# Altium schematic sheet Power.SchDoc
size A4; SheetNumber: 3; SheetTotal: 3
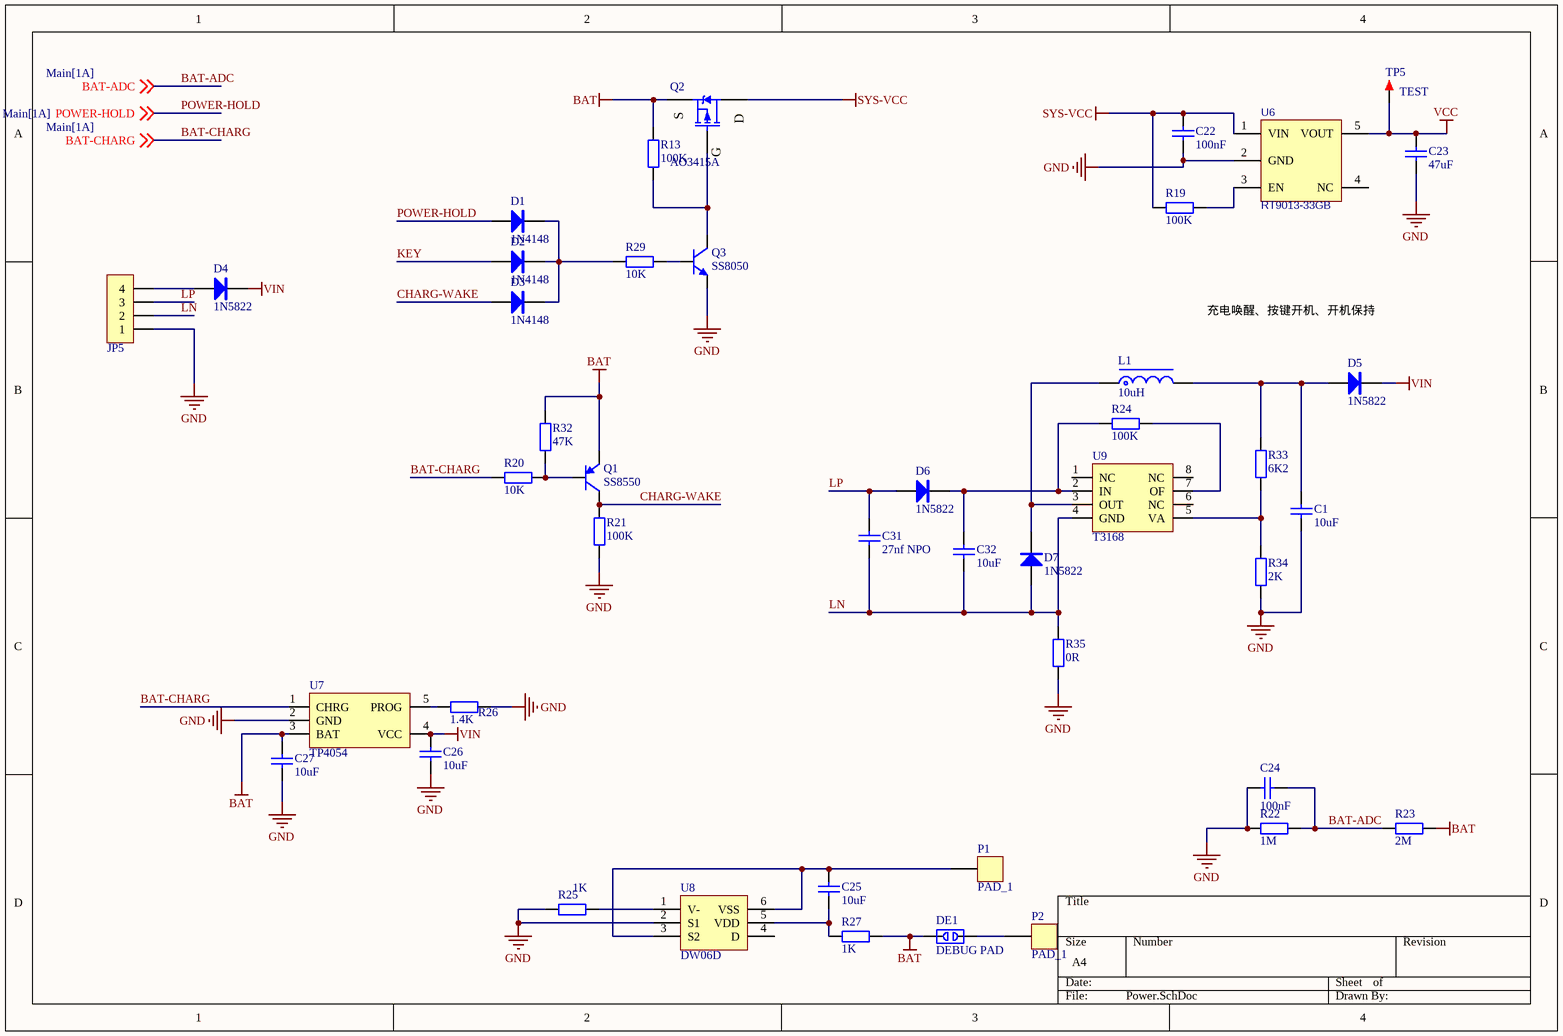
[diagram p0: Power.SchDoc]

## Parts
C1  10uF  [C1206_M]
C22  100nF  [C0402_M]
C23  47uF  [C0603_L]
C24  100nF  [C0402_M]
C25  10uF  [C0402_M]
C26  10uF  [C0402_M]
C27  10uF  [C0402_M]
C31  27nf NPO  [C1206_M]
C32  10uF  [C1206_M]
D1  1N4148  [SOD-323]
D2  1N4148  [SOD-323]
D3  1N4148  [SOD-323]
D4  1N5822  [SOD-123]
D5  1N5822  [SOD-123]
D6  1N5822  [SOD-123]
D7  1N5822  [SOD-123]
DE1  DEBUG PAD  [DEBUG_A]
JP5  HDR-1X4  [HDR2.54-LI-4P]  (value not drawn)
L1  10uH  [SWPA3012]
P1  PAD_1  [PAD-3.2X1.7]
P2  PAD_1  [PAD-3.2X1.7]
Q1  SS8550  [SOT23-3N]
Q2  AO3415A  [SOT23-3N]
Q3  SS8050  [SOT23-3N]
R13  100K  [R0402_M]
R19  100K  [R0402_M]
R20  10K  [R0402_M]
R21  100K  [R0402_M]
R22  1M  [R0402_M]
R23  2M  [R0402_M]
R24  100K  [R0402_M]
R25  1K  [R0402_M]
R26  1.4K  [R0402_M]
R27  1K  [R0402_M]
R29  10K  [R0402_M]
R32  47K  [R0402_M]
R33  6K2  [R0402_M]
R34  2K  [R0402_M]
R35  0R  [R0805_M]
TP5  TEST  [TEST 1.2]
U6  RT9013-33GB  [SOT-23-5]
U7  TP4054  [SOT23-5]
U8  DW06D  [SOT23-6L]
U9  T3168  [SOP8]

## Nets
BAT: C27.1 DE1.1 Q1.2(E) Q2.2(S) R13.2 R23.2 R27.2 R32.2 U7.3(BAT)
GND: C1.1 C22.1 C23.1 C24.2 C26.2 C27.2 JP5.1 Q3.2(E) R21.1 R22.1 R25.1 R26.2 R34.1 R35.2 U6.2(GND) U7.2(GND) U8.2(S1)
SYS-VCC: C22.2 Q2.3(D) R19.1 U6.1(VIN)
VCC: C23.2 TP5.1 U6.5(VOUT)
VIN: C26.1 D4.2(K) D5.2(K) U7.4(VCC)
BAT-ADC: C24.1 R22.2 R23.1 ; off-sheet BAT-ADC
BAT-CHARG: R20.2 U7.1(CHRG) ; off-sheet BAT-CHARG
CHARG-WAKE: D3.1(A) Q1.3(C) R21.2
KEY: D2.1(A)
LN: C31.1 C32.1 D7.1(A) JP5.2 R35.1 U9.4(GND)
LP: C31.2 D6.1(A) JP5.3
POWER-HOLD: D1.1(A) ; off-sheet POWER-HOLD
NetC1_2: C1.2 D5.1(A) L1.2 R33.2
NetC25_1: C25.1 P1.1 U8.3(S2) U8.6(VSS)
NetC25_2: C25.2 R27.1 U8.5(VDD)
NetC32_2: C32.2 D6.2(K) R24.1 U9.2(IN)
NetD1_2: D1.2(K) D2.2(K) D3.2(K) R29.2
NetD4_1: D4.1(A) JP5.4
NetD7_2: D7.2(K) L1.1 U9.3(OUT)
NetDE1_2: DE1.2 P2.1
NetQ1_1: Q1.1(B) R20.1 R32.1
NetQ2_1: Q2.1(G) Q3.3(C) R13.1
NetQ3_1: Q3.1(B) R29.1
NetR19_2: R19.2 U6.3(EN)
NetR24_2: R24.2 U9.7(OF)
NetR25_2: R25.2 U8.1(V-)
NetR26_1: R26.1 U7.5(PROG)
NetR33_1: R33.1 R34.2 U9.5(VA)

Not connected (* = marked no-connect by the designer): U6 4(NC); U8 4(D); U9 1(NC) 6(NC) 8(NC)

## Notes on the sheet
- 充电唤醒、按键开机、开机保持

## Library data of the parts
C1 C22-C27 C31 C32 = C: 贴片电容/MLCC电容; BOM名称: 无极性贴片电容; 联系下单店铺卖家 免费帮你查找封装: 联系下单店铺卖家 免费技术支持
D1-D3 = 1N4148: 开关二极管; BOM名称: 高速开关二极管; 以赠品形式获赠本封装库的买家，还可联系卖家免费指导AD软件使用: 封装库来自淘宝卖家ID：黄晶宝石
D4-D7 = 1N5822: 肖特基二极管; 以赠品形式获赠本封装库的买家，还可联系卖家免费指导AD软件使用: 封装库来自淘宝卖家ID：黄晶宝石; BOM名称: 肖特基二极管
DE1 = DEBUG: 调试断点焊盘; 联系卖家，免费查找封装: 唯一出售店铺网址https://shop463601444.taobao.com; 封装库来自淘宝卖家：黄晶宝石: 其他店铺购入均为盗版封装库，请立即申请退款，本店现金奖励200~1000元; BOM名称: 调试断点焊盘
JP5 = Header 4: 4P接插件; 联系卖家，免费查找封装: 唯一出售店铺网址https://shop463601444.taobao.com; 封装库来自淘宝卖家ID：黄晶宝石: 其他店铺购入均为盗版封装库，请立即申请退款，本店现金奖励50~200元; BOM名称: 4P接插件
L1 = L-SWPA: 顺络_SWPA贴片屏蔽电感; BOM名称: 功率屏蔽电感; 联系下单店铺卖家 免费帮你查找封装: 联系下单店铺卖家 免费技术支持
P1 P2 = PAD_1: 焊盘
Q1 = 8550-SMD: 高频放大-PNP型; 参数: 40V 1.5A 1W 100MHZ; 8元以下特价购入的买家: 还可以联系卖家远程指导AD软件使用; BOM名称: 高频放大-PNP型
Q2 = AO3415A: P沟道 20V/4A; BOM名称: 场效应管; 参数: P沟道 30V/4.2A; 8元以下特价购入的买家: 还可以联系卖家远程指导AD软件使用
Q3 = 8050-SMD: 高频放大-NPN型; 参数: 40V 1.5A 1W 100MHZ; 8元以下特价购入的买家: 还可以联系卖家远程指导AD软件使用; BOM名称: 高频放大-NPN型
R13 R19-R27 R29 R32-R35 = R: 贴片电阻; 联系下单店铺卖家 免费帮你查找封装: 联系下单店铺卖家 免费技术支持; BOM名称: 贴片电阻
TP5 = TEST: 测试点; 联系卖家，免费查找封装: 唯一出售店铺网址https://shop463601444.taobao.com; 封装库来自淘宝卖家：黄晶宝石: 其他店铺购入均为盗版封装库，请立即申请退款，本店现金奖励200~1000元; BOM名称: 测试点
U6 = RT9013-33GB: LDO 3.3V/0.5A; BOM名称: RT9193-30GB; 芯片厂商: RICHTEK; 封装库来自淘宝卖家：黄晶宝石: 其他店铺购入的买家，请立即申请退款，本店现金奖励200~1000元
U7 = TP4054: 锂电池充电芯片
U8 = DW06D: 二合一锂电池保护IC
U9 = T3168: T3168无线充芯片